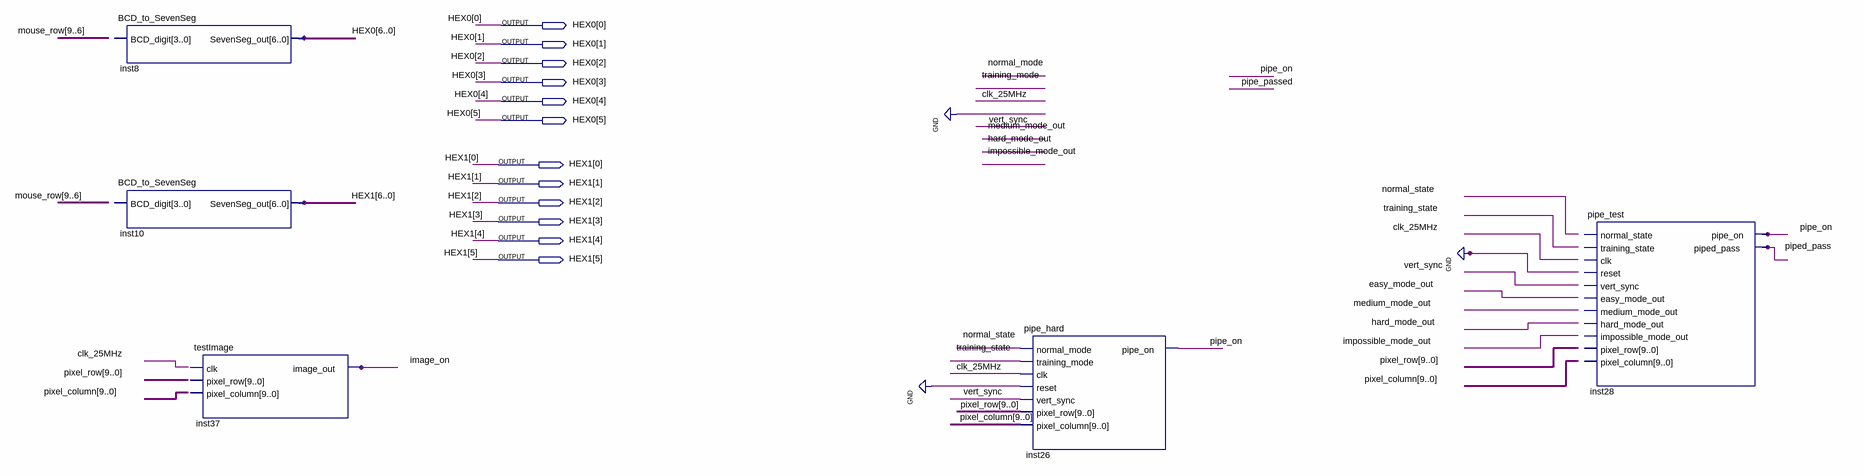
[diagram p0: schematic sheet]
// Quartus schematic extracomponents.bdf as structural Verilog: 5 symbols, 12 pins
module extracomponents (
  output [6:0] HEX0,
  output [6:0] HEX1
);

  wire clk_25MHz, image_on, normal_state, pipe_on, piped_pass, training_state, vert_sync;
  wire [9:0] pixel_column, pixel_row;

  BCD_to_SevenSeg inst8 (.SevenSeg_out(HEX0));  // open: BCD_digit
  BCD_to_SevenSeg inst10 (.SevenSeg_out(HEX1));  // open: BCD_digit
  testImage inst37 (.image_out(image_on));  // open: clk, pixel_row, pixel_column
  pipe_hard inst26 (
    .normal_mode(normal_state), .training_mode(training_state), .clk(clk_25MHz), .reset(1'b0),
    .vert_sync(vert_sync), .pixel_row(pixel_row), .pixel_column(pixel_column), .pipe_on(pipe_on));
  pipe_test inst28 (
    .pipe_on(pipe_on), .piped_pass(piped_pass));  // open: normal_state, training_state, clk, reset, vert_sync, easy_mode_out, medium_mode_out, hard_mode_out, impossible_mode_out, pixel_row, pixel_column
endmodule
